# EAGLE schematic ENGR301-project-Fall2023  (EAGLE 9.6.2)

## Sheet 1 of 2
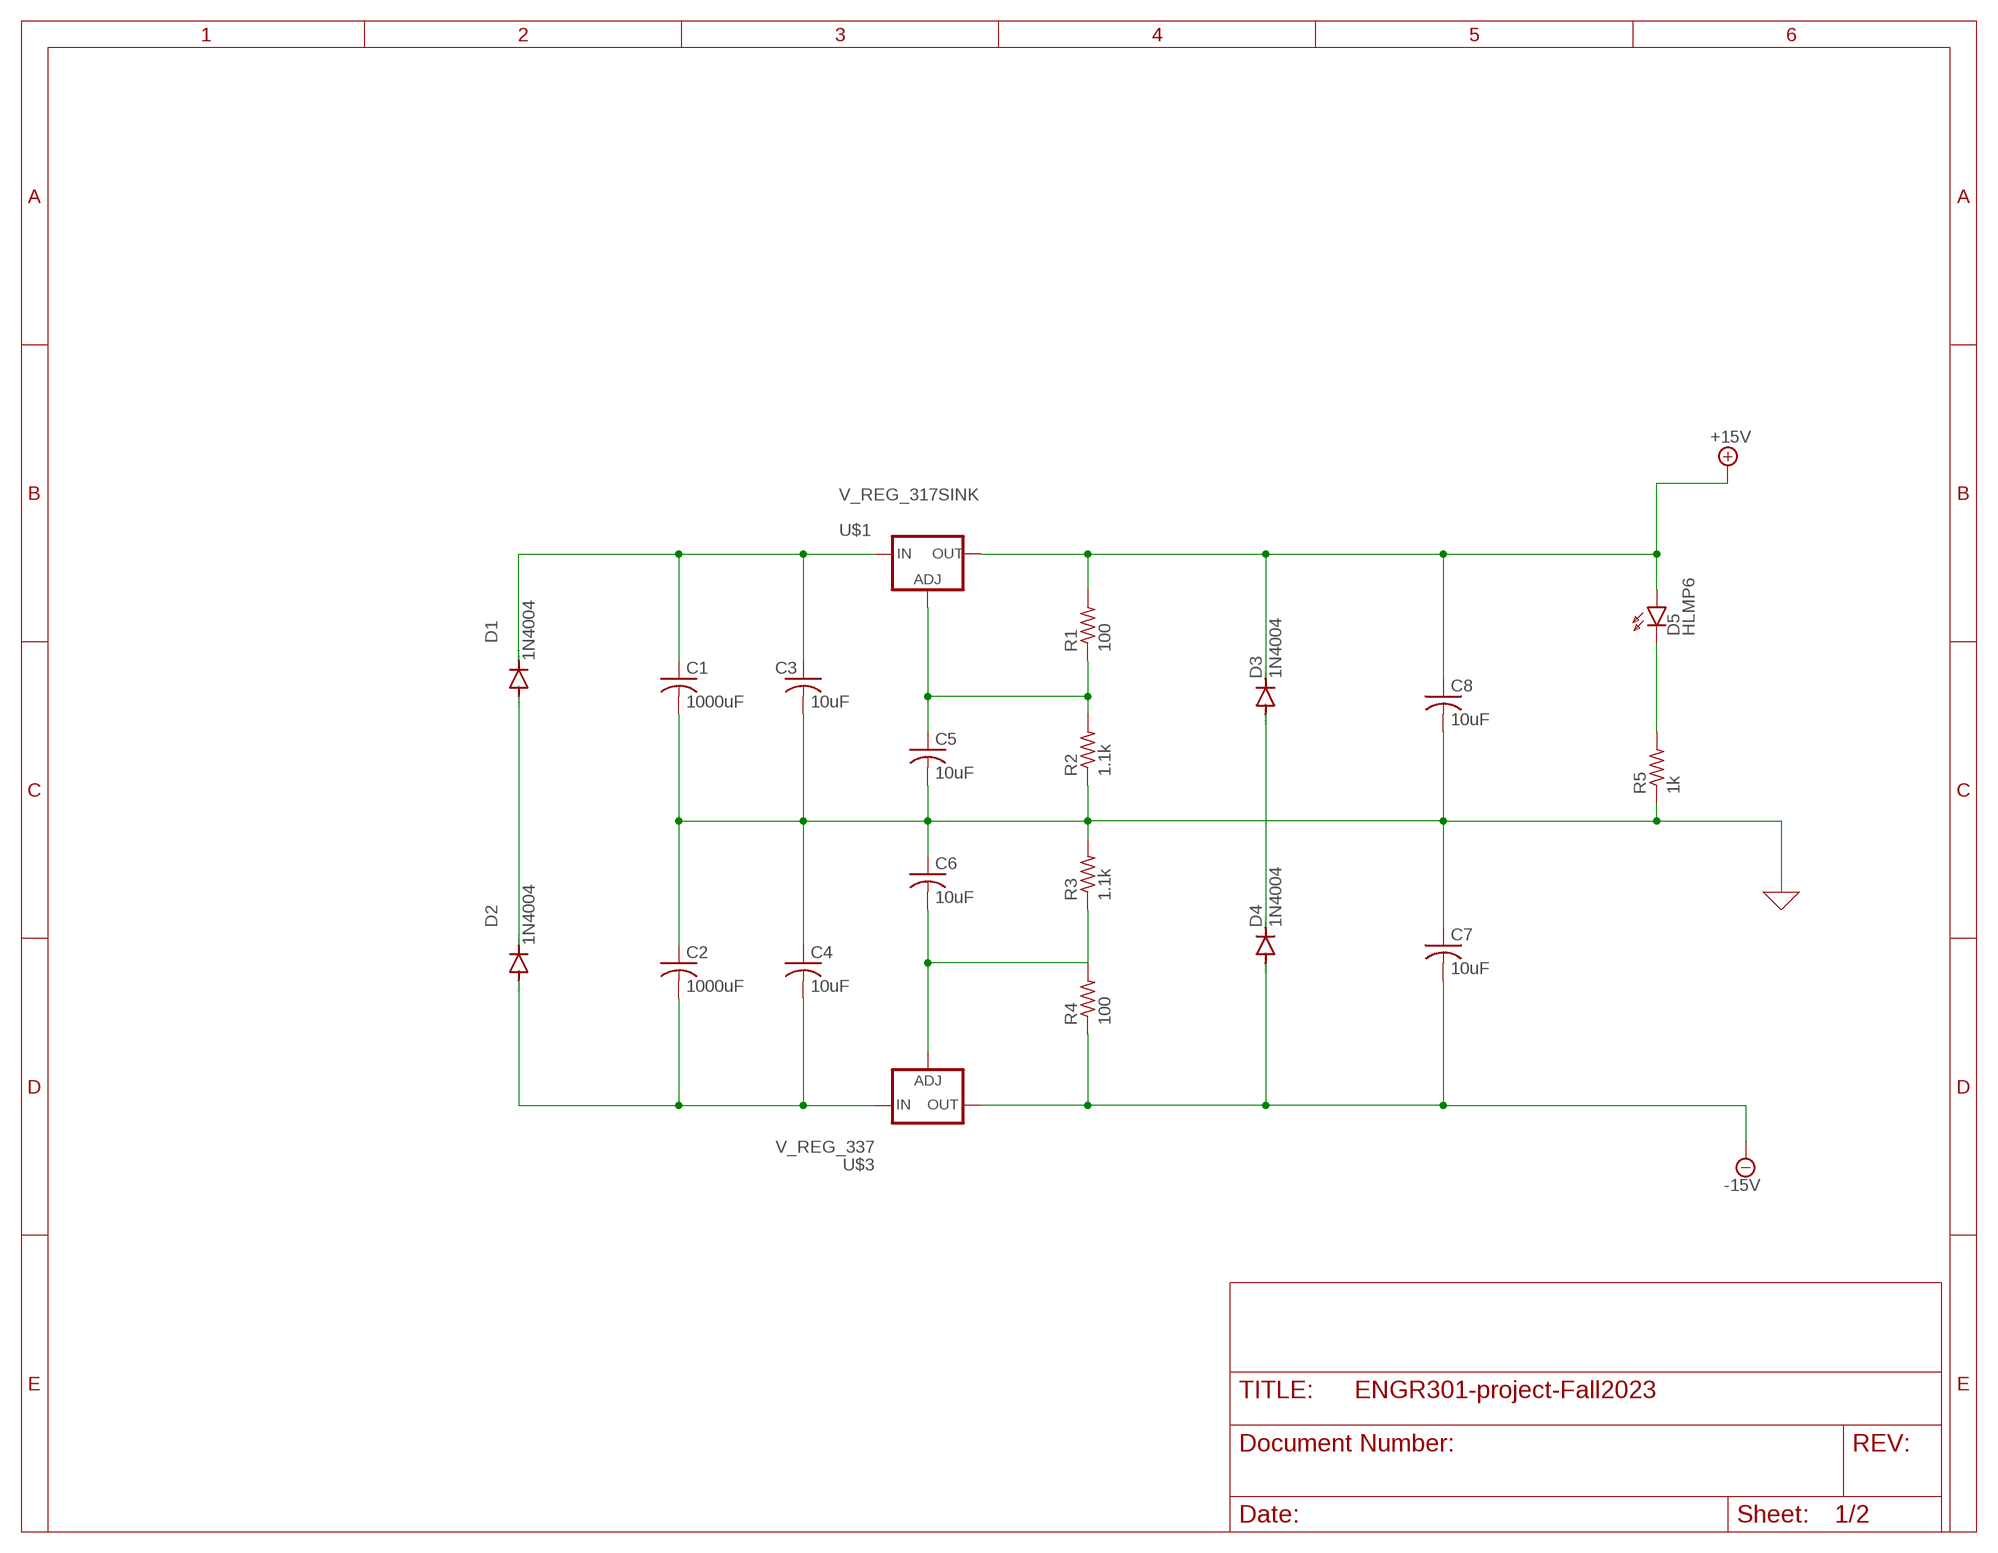
[diagram p0: schematic, sheet 1]

### Parts
C1  1000uF  C-US050-024X044  [C050-024X044]
C2  1000uF  C-US050-024X044  [C050-024X044]
C3  10uF  C-US050-024X044  [C050-024X044]
C4  10uF  C-US050-024X044  [C050-024X044]
C5  10uF  C-US050-024X044  [C050-024X044]
C6  10uF  C-US050-024X044  [C050-024X044]
C7  10uF  C-US050-024X044  [C050-024X044]
C8  10uF  C-US050-024X044  [C050-024X044]
D1  1N4004  [DO41-10]
D2  1N4004  [DO41-10]
D3  1N4004  [DO41-10]
D4  1N4004  [DO41-10]
D5  HLMP6  [HLMP6]
R1  100  R-US_0204/7  [0204/7]
R2  1.1k  R-US_0204/7  [0204/7]
R3  1.1k  R-US_0204/7  [0204/7]
R4  100  R-US_0204/7  [0204/7]
R5  1k  R-US_0204/7  [0204/7]
U$1  V_REG_317SINK  [TO220-ADJ]
U$3  V_REG_337  [TO220-ADJ-NEG]

### Nets
0: C1.2 C2.1 C3.2 C4.1 C5.2 C6.1 C7.1 C8.2 R2.1 R3.2 R5.1 ; supply symbol labelled GND ; also sheet 2
+15V: C8.1 D3.C D5.A R1.2 U$1.OUT ; also sheet 2
-15V: C7.2 D4.A R4.1 U$3.OUT ; also sheet 2
N$1: D1.A D2.C
N$2: C2.2 C4.2 D2.A U$3.IN
N$3: C1.1 C3.1 D1.C U$1.IN
N$10: C5.1 R1.1 R2.2 U$1.ADJ
N$12: C6.2 R3.1 R4.2 U$3.ADJ
N$14: D3.A D4.C
N$16: D5.K R5.2

## Sheet 2 of 2
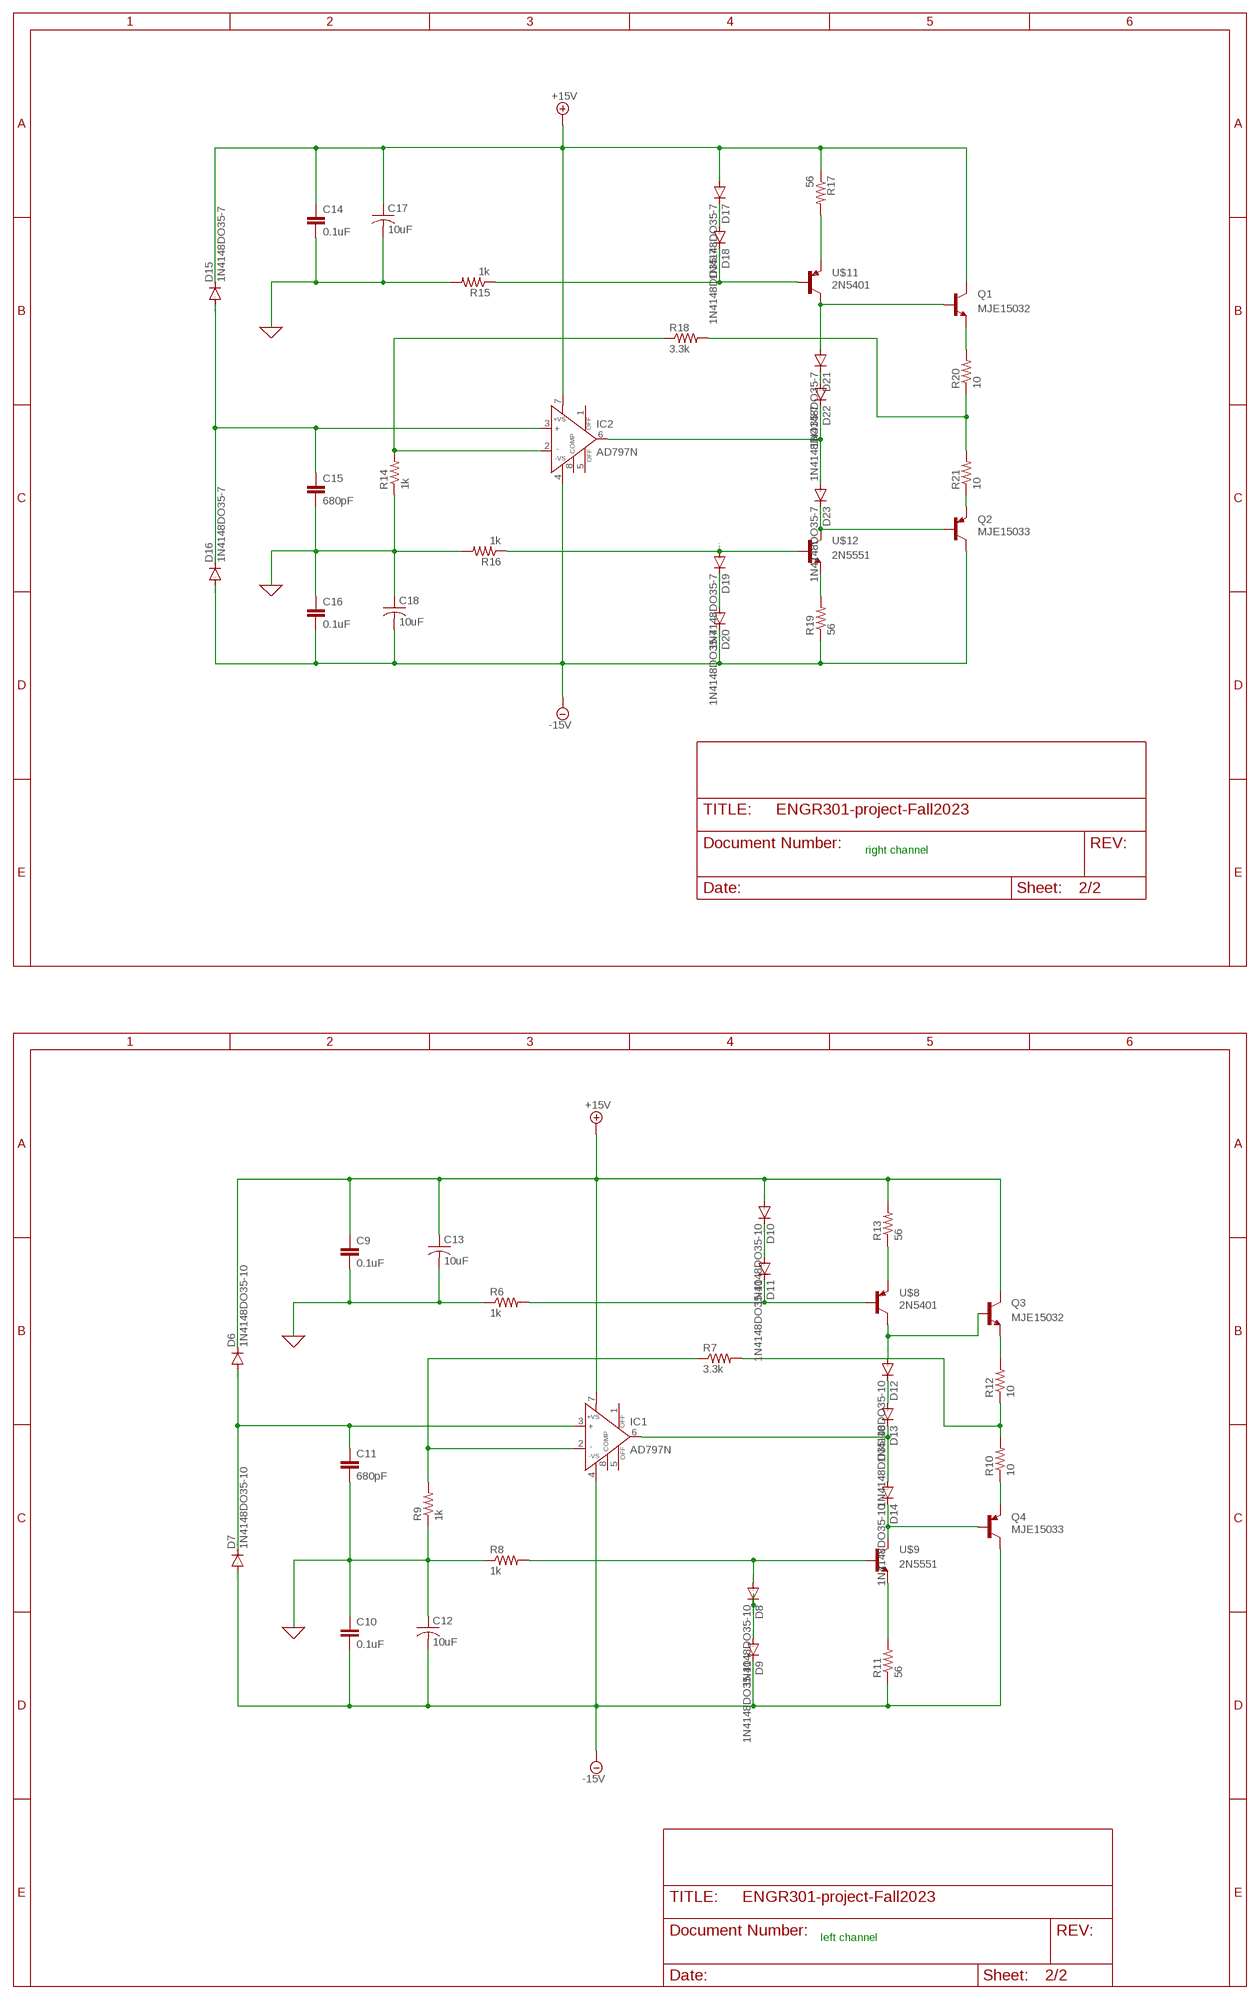
[diagram p1: schematic, sheet 2]

### Parts
C9  0.1uF  C2,5-3  [C2.5-3]
C10  0.1uF  C2,5-3  [C2.5-3]
C11  680pF  C2,5-3  [C2.5-3]
C12  10uF  C-US050-024X044  [C050-024X044]
C13  10uF  C-US050-024X044  [C050-024X044]
C14  0.1uF  C2,5-3  [C2.5-3]
C15  680pF  C2,5-3  [C2.5-3]
C16  0.1uF  C2,5-3  [C2.5-3]
C17  10uF  C-US050-024X044  [C050-024X044]
C18  10uF  C-US050-024X044  [C050-024X044]
D6  1N4148DO35-10  [DO35-10]
D7  1N4148DO35-10  [DO35-10]
D8  1N4148DO35-10  [DO35-10]
D9  1N4148DO35-10  [DO35-10]
D10  1N4148DO35-10  [DO35-10]
D11  1N4148DO35-10  [DO35-10]
D12  1N4148DO35-10  [DO35-10]
D13  1N4148DO35-10  [DO35-10]
D14  1N4148DO35-10  [DO35-10]
D15  1N4148DO35-7  [DO35-7]
D16  1N4148DO35-7  [DO35-7]
D17  1N4148DO35-7  [DO35-7]
D18  1N4148DO35-7  [DO35-7]
D19  1N4148DO35-7  [DO35-7]
D20  1N4148DO35-7  [DO35-7]
D21  1N4148DO35-7  [DO35-7]
D22  1N4148DO35-7  [DO35-7]
D23  1N4148DO35-7  [DO35-7]
IC1  AD797N  [DIL08]
IC2  AD797N  [DIL08]
Q1  MJE15032  [TO220V]
Q2  MJE15033  [TO220V]
Q3  MJE15032  [TO220V]
Q4  MJE15033  [TO220V]
R6  1k  R-US_0204/7  [0204/7]
R7  3.3k  R-US_0204/7  [0204/7]
R8  1k  R-US_0204/7  [0204/7]
R9  1k  R-US_0204/7  [0204/7]
R10  10  R-US_0204/7  [0204/7]
R11  56  R-US_0204/7  [0204/7]
R12  10  R-US_0204/7  [0204/7]
R13  56  R-US_0204/7  [0204/7]
R14  1k  R-US_0204/7  [0204/7]
R15  1k  R-US_0204/7  [0204/7]
R16  1k  R-US_0204/7  [0204/7]
R17  56  R-US_0204/7  [0204/7]
R18  3.3k  R-US_0204/7  [0204/7]
R19  56  R-US_0204/7  [0204/7]
R20  10  R-US_0204/7  [0204/7]
R21  10  R-US_0204/7  [0204/7]
U$8  2N5401  [2N5401]
U$9  2N5551  [2N5551]
U$11  2N5401  [2N5401]
U$12  2N5551  [2N5551]

### Nets
0: C9.2 C10.1 C11.2 C12.1 C13.2 C14.2 C15.2 C16.1 C17.2 C18.1 R6.1 R8.1 R9.1 R14.1 R15.2 R16.2 ; supply symbol labelled GND ; also sheet 1
+15V: C9.1 C13.1 C14.1 C17.1 D6.C D10.A D15.C D17.A IC1.7(+VS) IC2.7(+VS) Q1.2(C) Q3.2(C) R13.2 R17.1 ; also sheet 1
-15V: C10.2 C12.2 C16.2 C18.2 D7.A D9.C D16.A D20.C IC1.4(-VS) IC2.4(-VS) Q2.2(C) Q4.2(C) R11.1 R19.1 ; also sheet 1
N$4: C11.1 D6.A D7.C IC1.3(IN+)
N$6: D11.C R6.2 U$8.B
N$7: D10.C D11.A
N$8: R13.1 U$8.C(E)
N$9: D8.A R8.2 U$9.B
N$11: D8.C D9.A
N$15: R11.2 U$9.E
N$17: D12.A Q3.1(B) U$8.E(C)
N$18: D12.C D13.A
N$19: D13.C D14.A IC1.6(OUT)
N$20: D14.C Q4.1(B) U$9.C
N$21: IC1.2(IN-) R7.1 R9.2
N$22: Q3.3(E) R12.2
N$23: R7.2 R10.2 R12.1
N$24: Q4.3(E) R10.1
N$26: D18.C R15.1 U$11.B
N$27: D17.C D18.A
N$28: R17.2 U$11.C(E)
N$29: D21.A Q1.1(B) U$11.E(C)
N$31: D19.C D20.A
N$32: C15.1 D15.A D16.C IC2.3(IN+)
N$33: IC2.2(IN-) R14.2 R18.1
N$35: D19.A R16.1 U$12.B
N$36: R19.2 U$12.E
N$37: D23.C Q2.1(B) U$12.C
N$38: D22.C D23.A IC2.6(OUT)
N$39: D21.C D22.A
N$40: Q2.3(E) R21.1
N$41: R18.2 R20.1 R21.2
N$42: Q1.3(E) R20.2
Unconnected: IC1.1(OFF) IC1.5(OFF) IC1.8(COMP) IC2.1(OFF) IC2.5(OFF) IC2.8(COMP)

### Notes on the sheet
- right channel
- left channel

## Library data of the parts
C1-C8 C12 C13 C17 C18 = rcl:C-US: CAPACITOR, American symbol; SPICEPREFIX: C
C9-C11 C14-C16 = capacitor-wima:C: CAPACITOR naming: grid - package width
D1-D4 = diode:1N4004: DIODE general purpose rectifier, 1 A
D5 = display-hp:HLMP6: LED 2mm horizontal; MF: AGILENT TECHNOLOGIES; MPN: HLMP-6500; OC_FARNELL: 1652490; OC_NEWARK: 40K0088
D6-D23 = diode:1N4148: DIODE high speed (Philips)
IC1 IC2 = analog-devices:AD797: Ultralow Distortion, Ultralow Noise Op Amp Source: http://www.analog.com/static/imported-files/data_sheets/AD797.pdf; MF: ALTERA CORPORATION; MPN: AD797ANZ; OC_FARNELL: 9603778; OC_NEWARK: 59K6088
Q1 Q3 = engr301-proj :MJE15032: NPN Power Transistor HF Audio Driver 8.0A, 250V, 50W
Q2 Q4 = engr301-proj :MJE15033: PNP Power Transistor HF Audio Driver 8.0A, 250V, 50W
R1-R21 = rcl:R-US_: RESISTOR, American symbol; SPICEPREFIX: R
U$1 = engr301-proj :V_REG_317: Voltage Regulator Standard LM317 adjustable voltage regulator. AOI (Adjust Output Input). Google 'LM317 Calculator' for easy to use app to get the two resistor values needed. 240/720 for 5V output. 240/390 for 3.3V output. Spark Fun Electronics SKU : COM-00527
U$3 = engr301-proj :V_REG_337: LM-337 Negative Adjustable Voltage Regulator
U$8 U$11 = engr301-proj :2N5401
U$9 U$12 = engr301-proj :2N5551